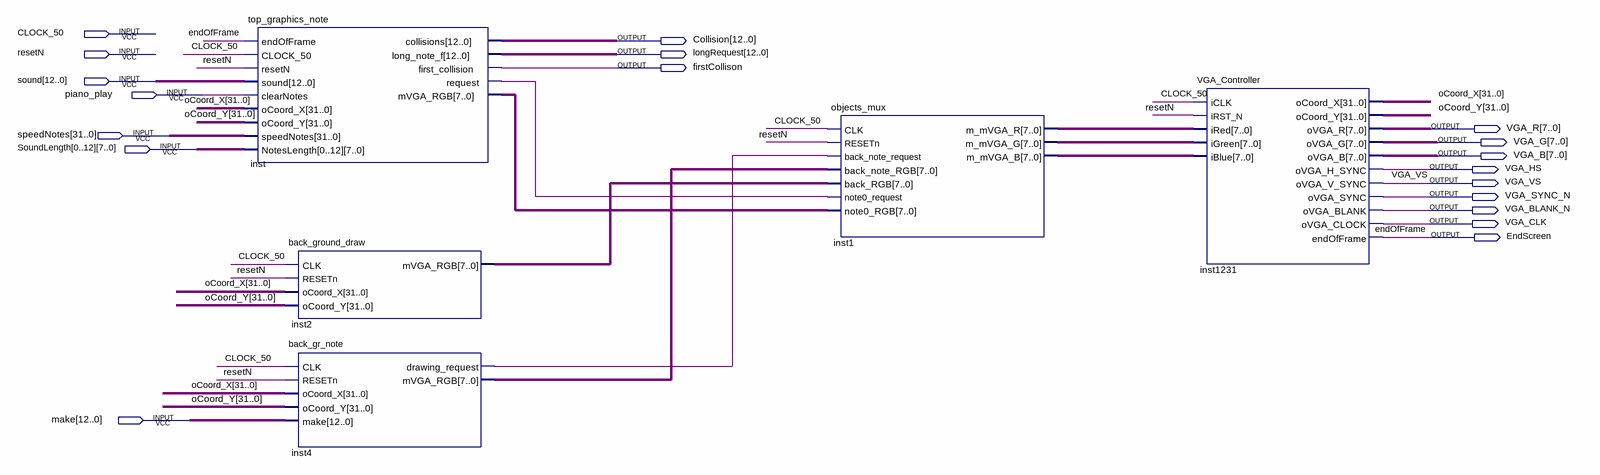
[diagram p0: schematic sheet]
// Quartus schematic graphics_module_diag.bdf as structural Verilog: 5 symbols, 19 pins
module graphics_module_diag (
  input  CLOCK_50,
  input  resetN,
  input  [12:0] sound,
  input  piano_play,
  input  [31:0] speedNotes,
  input  [7:0] SoundLength_0,
  input  [7:0] SoundLength_1,
  input  [7:0] SoundLength_2,
  input  [7:0] SoundLength_3,
  input  [7:0] SoundLength_4,
  input  [7:0] SoundLength_5,
  input  [7:0] SoundLength_6,
  input  [7:0] SoundLength_7,
  input  [7:0] SoundLength_8,
  input  [7:0] SoundLength_9,
  input  [7:0] SoundLength_10,
  input  [7:0] SoundLength_11,
  input  [7:0] SoundLength_12,
  input  [12:0] make,
  output [12:0] Collision,
  output [12:0] longRequest,
  output firstCollison,
  output [7:0] VGA_R,
  output [7:0] VGA_G,
  output [7:0] VGA_B,
  output VGA_HS,
  output VGA_VS,
  output VGA_SYNC_N,
  output VGA_BLANK_N,
  output VGA_CLK,
  output EndScreen
);

  wire inst4_drawing_request, inst_request;
  wire [7:0] inst1_m_mvga_b, inst1_m_mvga_g, inst1_m_mvga_r, inst2_mvga_rgb, inst4_mvga_rgb, inst_mvga_rgb;
  wire [31:0] oCoord_X, oCoord_Y;

  top_graphics_note inst (
    .endOfFrame(EndScreen), .CLOCK_50(CLOCK_50), .resetN(resetN), .sound(sound), .clearNotes(piano_play),
    .oCoord_X(oCoord_X), .oCoord_Y(oCoord_Y), .speedNotes(speedNotes),
    .NotesLength({SoundLength_0, SoundLength_1, SoundLength_2, SoundLength_3, SoundLength_4, SoundLength_5, SoundLength_6, SoundLength_7, SoundLength_8, SoundLength_9, SoundLength_10, SoundLength_11, SoundLength_12}),
    .collisions(Collision), .long_note_f(longRequest), .first_collision(firstCollison),
    .request(inst_request), .mVGA_RGB(inst_mvga_rgb));
  back_ground_draw inst2 (
    .CLK(CLOCK_50), .RESETn(resetN), .oCoord_X(oCoord_X), .oCoord_Y(oCoord_Y), .mVGA_RGB(inst2_mvga_rgb));
  back_gr_note inst4 (
    .CLK(CLOCK_50), .RESETn(resetN), .oCoord_X(oCoord_X), .oCoord_Y(oCoord_Y), .make(make),
    .drawing_request(inst4_drawing_request), .mVGA_RGB(inst4_mvga_rgb));
  objects_mux inst1 (
    .CLK(CLOCK_50), .RESETn(resetN), .back_note_request(inst4_drawing_request),
    .back_note_RGB(inst4_mvga_rgb), .back_RGB(inst2_mvga_rgb), .note0_request(inst_request),
    .note0_RGB(inst_mvga_rgb), .m_mVGA_R(inst1_m_mvga_r), .m_mVGA_G(inst1_m_mvga_g), .m_mVGA_B(inst1_m_mvga_b));
  VGA_Controller inst1231 (
    .iCLK(CLOCK_50), .iRST_N(resetN), .iRed(inst1_m_mvga_r), .iGreen(inst1_m_mvga_g), .iBlue(inst1_m_mvga_b),
    .oCoord_X(oCoord_X), .oCoord_Y(oCoord_Y), .oVGA_R(VGA_R), .oVGA_G(VGA_G), .oVGA_B(VGA_B),
    .oVGA_H_SYNC(VGA_HS), .oVGA_V_SYNC(VGA_VS), .oVGA_SYNC(VGA_SYNC_N), .oVGA_BLANK(VGA_BLANK_N),
    .oVGA_CLOCK(VGA_CLK), .endOfFrame(EndScreen));

  // Other names for the same wires on the sheet: endOfFrame = EndScreen
endmodule
